# EasyEDA schematic overear_schematic_original_format.json
TITLE: OverEar Schematic; REV: 1.0; Date: 2022-4-12; Sheet: 1/1; Drawn By: Team 4 OverEar
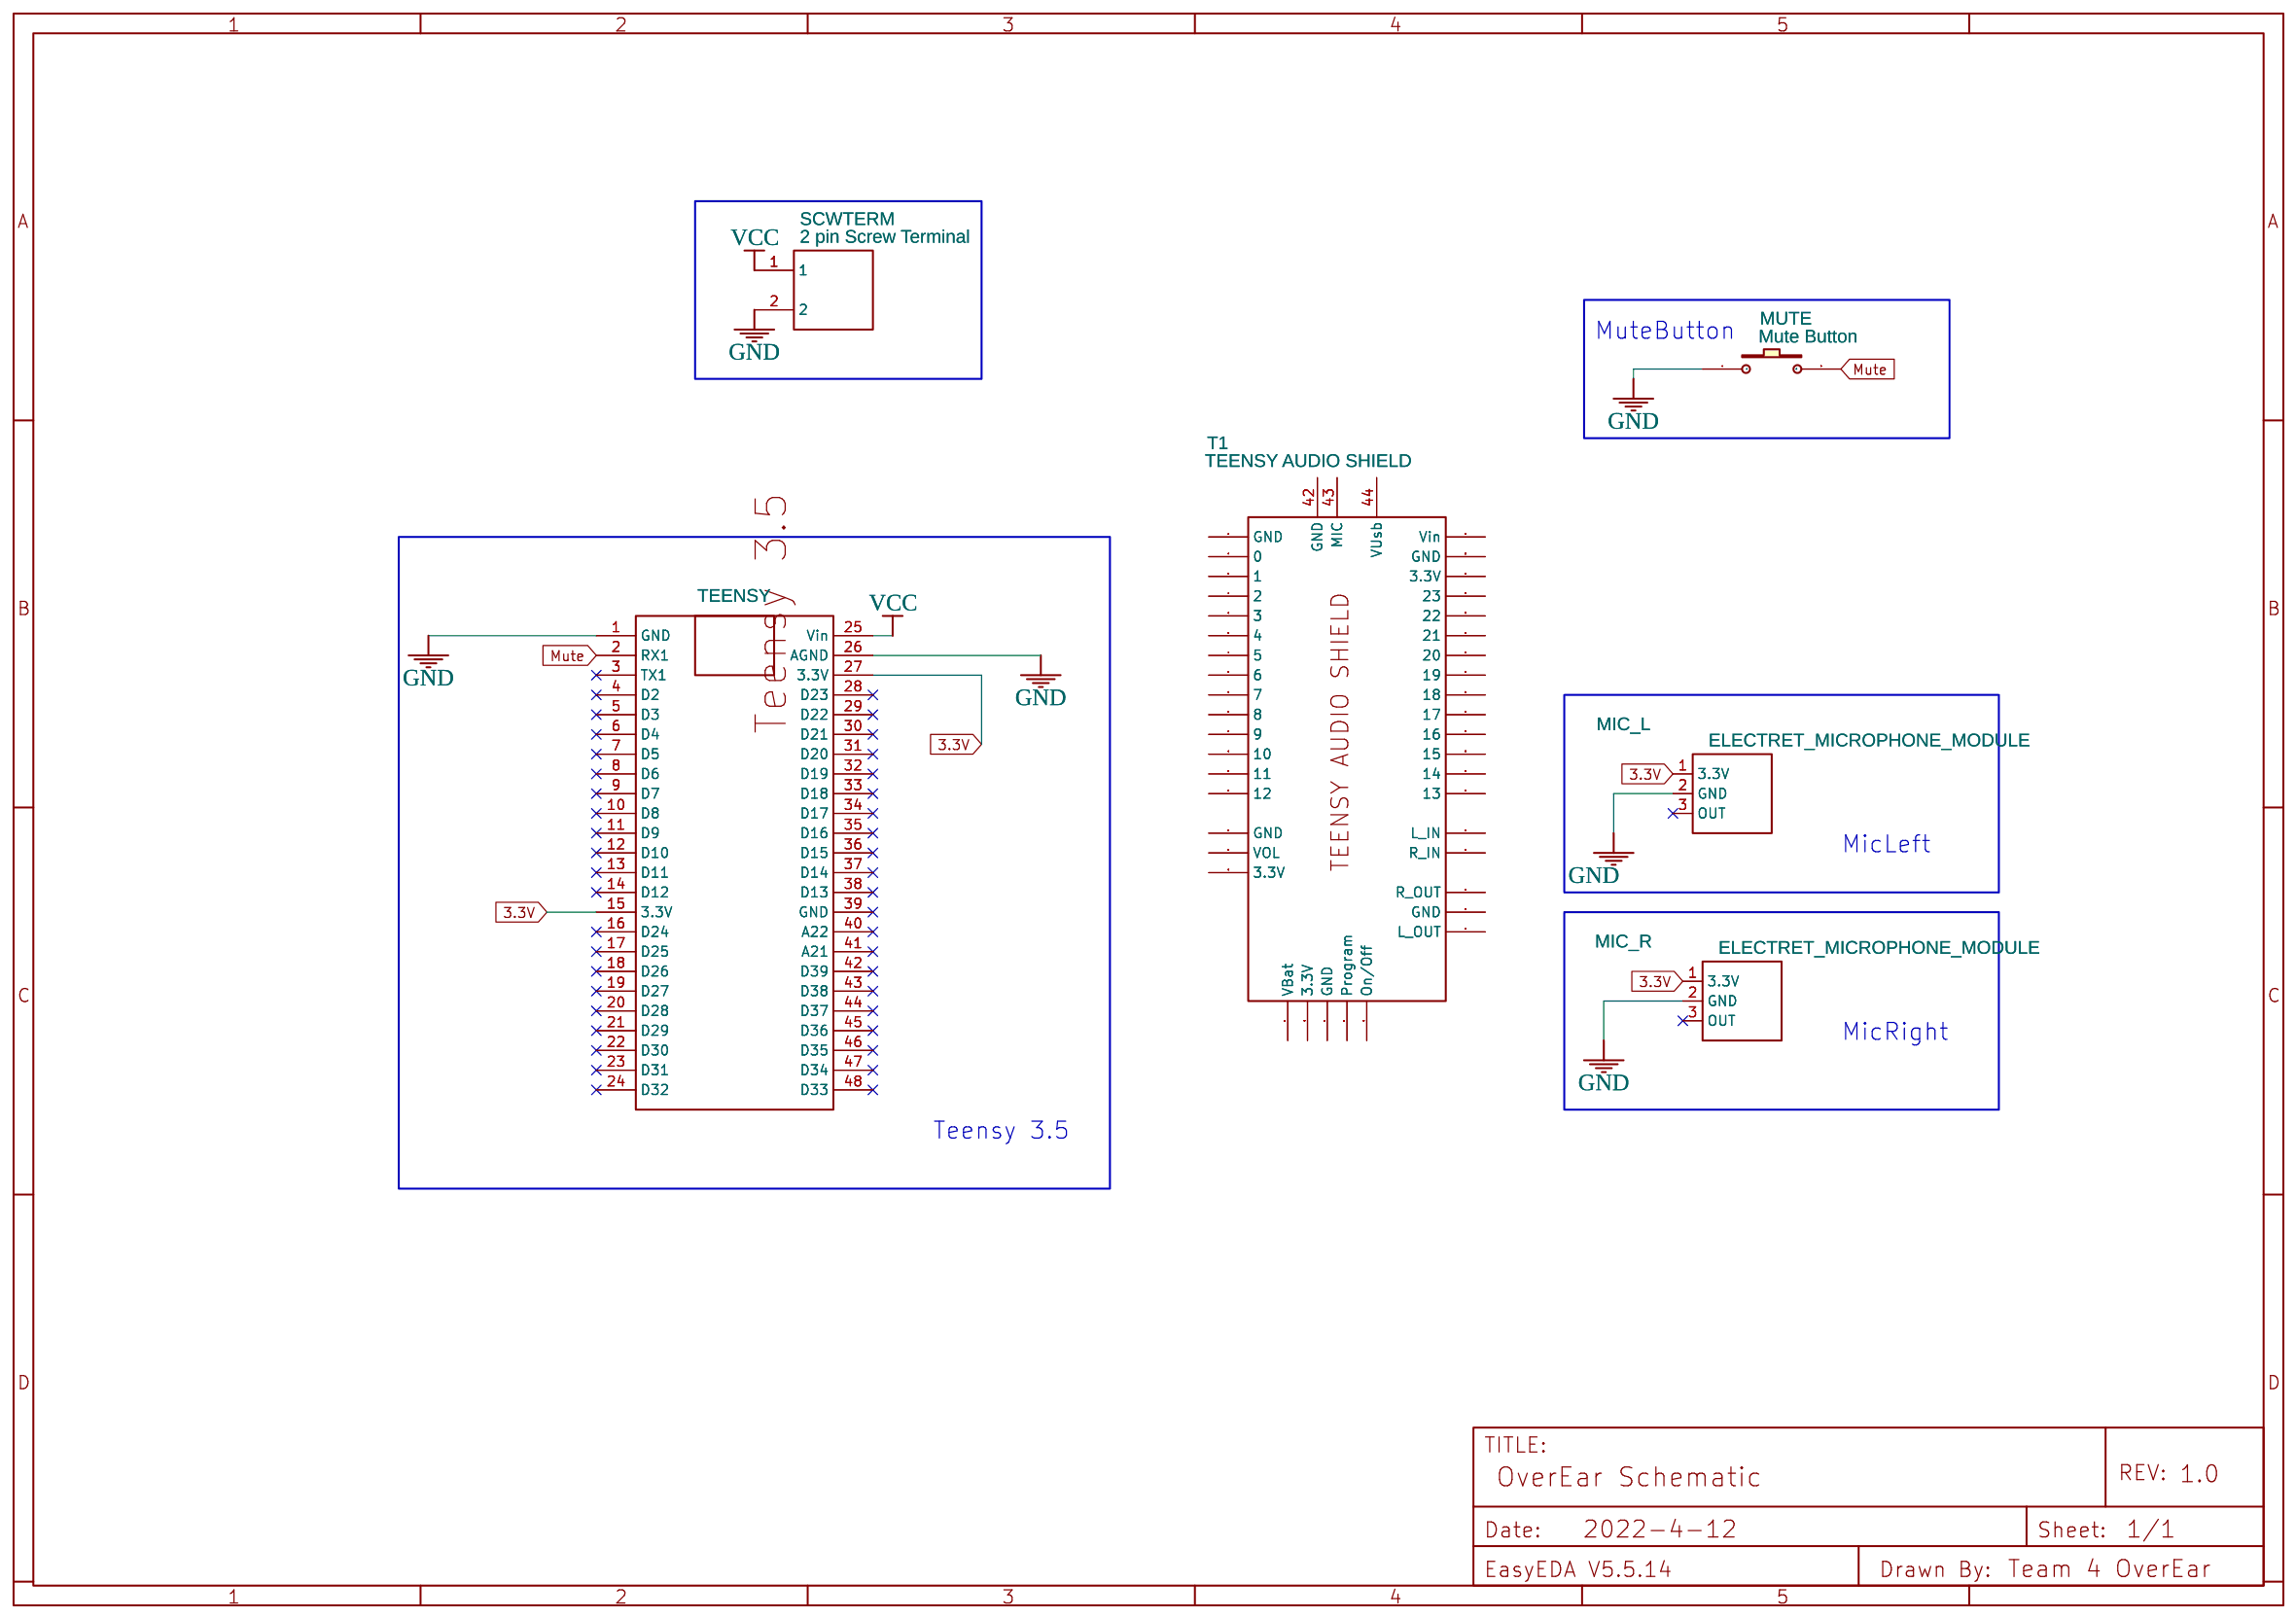
[diagram p0: schematic sheet]

## Parts
MIC_L  ELECTRET_MICROPHONE_MODULE  [ELECTRET_MICROPHONE_MODULE]
MIC_R  ELECTRET_MICROPHONE_MODULE  [ELECTRET_MICROPHONE_MODULE]
MUTE  Mute Button  [PUSH BUTTON 2 PIN SQUARE]
SCWTERM  2 pin Screw Terminal  [2 PIN SCREW TERMINAL]
T1  TEENSY AUDIO SHIELD  [TEENSY AUDIO SHIELD BREAKOUT]
TEENSY  Teensy 3.5  [TEENSY 3.5]

## Library data of the parts
MIC_L MIC_R = ELECTRET_MICROPHONE_MODULE: link: https://www.myarduino.net/product/2057/electret-microphone-sound-sencor-amplifier-max4466-%E0%B9%80%E0%B8%8B%E0%B9%87%E0%B8%99%E0%B9%80%E0%B8%8B%E0%B8%AD%E0%B8%A3%E0%B9%8C%E0%B9%80%E0%B8%AA%E0%B8%B5%E0%B8%A2%E0%B8%87%E0%B8%84%E0%B8%A7%E0%B8%B2%E0%B8%A1%E0%B9%84%E0%B8%A7%E0%B8%AA%E0%B8%B9%E0%B8%87; Contributor: MEBenz
MUTE = Button1: sourceId: K60iAuM3l
SCWTERM = 2 pin Screw Terminal: Contributor: yatin27082001
T1 = TEENSY AUDIO SHIELD: Manufacturer Part: PJRC; link: https://www.pjrc.com/store/teensy3_audio.html; Contributor: mlch
TEENSY = -: link: https://www.pjrc.com/store/teensy36.html; Contributor: travisbavar

## Nets
3.3V: MIC_L.1(3.3V) MIC_R.1(3.3V) TEENSY.15(3.3V) TEENSY.27(3.3V)
GND: MIC_L.2(GND) MIC_R.2(GND) MUTE.1 SCWTERM.2 TEENSY.1(GND) TEENSY.26(AGND)
VCC: SCWTERM.1 TEENSY.25(Vin)
Mute: MUTE.2 TEENSY.2(RX1)

Not connected (* = marked no-connect by the designer): MIC_L 3(OUT)*; MIC_R 3(OUT)*; T1 1(GND) 2(0) 3(1) 4(2) 5(3) 6(4) 7(5) 8(6) 9(7) 10(8) 11(9) 12(10) 13(11) 14(12) 15(VBat) 16(3.3V) 17(GND) 18(Program) 19(On/Off) 20(13) 21(14) 22(15) 23(16) 24(17) 25(18) 26(19) 27(20) 28(21) 29(22) 30(23) 31(3.3V) 32(GND) 33(Vin) 34(3.3V) 35(VOL) 36(GND) 37(L_IN) 38(R_IN) 39(R_OUT) 40(GND) 41(L_OUT) 42(GND) 43(MIC) 44(VUsb); TEENSY 3(TX1)* 4(D2)* 5(D3)* 6(D4)* 7(D5)* 8(D6)* 9(D7)* 10(D8)* 11(D9)* 12(D10)* 13(D11)* 14(D12)* 16(D24)* 17(D25)* 18(D26)* 19(D27)* 20(D28)* 21(D29)* 22(D30)* 23(D31)* 24(D32)* 28(D23)* 29(D22)* 30(D21)* 31(D20)* 32(D19)* 33(D18)* 34(D17)* 35(D16)* 36(D15)* 37(D14)* 38(D13)* 39(GND)* 40(A22)* 41(A21)* 42(D39)* 43(D38)* 44(D37)* 45(D36)* 46(D35)* 47(D34)* 48(D33)*

## Notes on the sheet
- MuteButton
- MicLeft
- MicRight
- Teensy 3.5
